# EAGLE design LED_Strip (EAGLE 6.6.0)
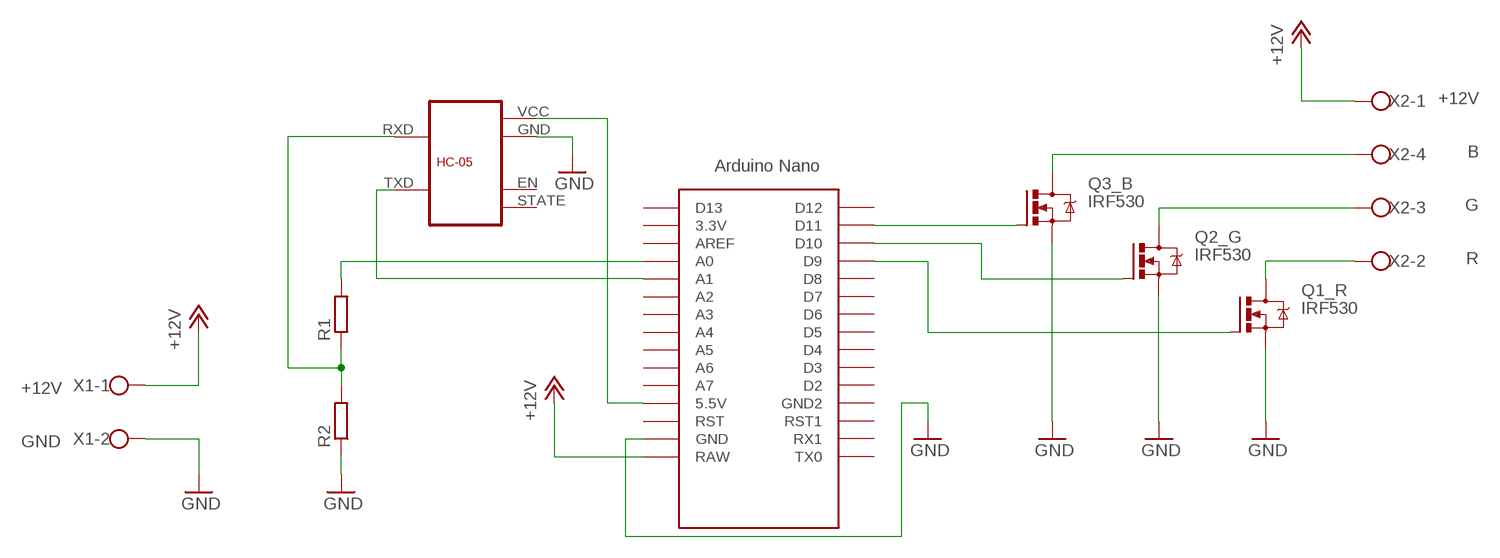
[diagram p0: schematic, sheet 1]

## Parts
Q1_R  IRF530  [TO220BV]
Q2_G  IRF530  [TO220BV]
Q3_B  IRF530  [TO220BV]
R1  R-EU0207/10  [0207/10]
R2  R-EU0207/10  [0207/10]
U$1  PAC_BLUETOOTH_HC-05  [BLUETOOTH_HC-05]
U$2  NANO  [NANO]
X1  W237-102_L  [W237-102_L]
X2  W237-04P_R  [W237-4P_R]

## Nets
+12V: U$2.RAW X1.1 X2.1
GND: Q1_R.S Q2_G.S Q3_B.S R2.1 U$1.GND U$2.GND X1.2
N$1: Q1_R.D X2.2
N$2: Q3_B.G U$2.D11
N$3: Q2_G.G U$2.D10
N$4: Q1_R.G U$2.D9
N$5: Q2_G.D X2.3
N$6: Q3_B.D X2.4
N$7: U$1.VCC U$2.5V(5.5V)
N$8: R1.1 R2.2 U$1.RXD
N$9: R1.2 U$2.A0
N$10: U$1.TXD U$2.A1
Unconnected: U$1.EN U$1.STATE U$2.3.3V U$2.A2 U$2.A3 U$2.A4 U$2.A5 U$2.A6 U$2.A7 U$2.AREF U$2.D2 U$2.D3 U$2.D4 U$2.D5 U$2.D6 U$2.D7 U$2.D8 U$2.D12 U$2.D13 U$2.GND1(GND2) U$2.ICSP1 U$2.ICSP2 U$2.ICSP3 U$2.ICSP4 U$2.ICSP5 U$2.ICSP6 U$2.RST U$2.RST1 U$2.RX1 U$2.TX0

## Notes on the sheet
- +12V
- B
- G
- R
- +12V
- GND

## Library data of the parts
Q1_R Q2_G Q3_B = transistor-power:IRF530: HEXFET Power MOSFET
R1 R2 = HTL_RCL:R-EU: RESISTOR, European symbol
U$1 = bluetooth_HC-05:PAC_BLUETOOTH_HC-05
U$2 = Arduino-clone:NANO: Arduino Nano
X1 = HTL_Printklemmen_links:W237-102_L: WAGO SCREW CLAMP
X2 = HTL_Printklemmen_rechts:W237-04P_R: WAGO SREW CLAMP

## Board
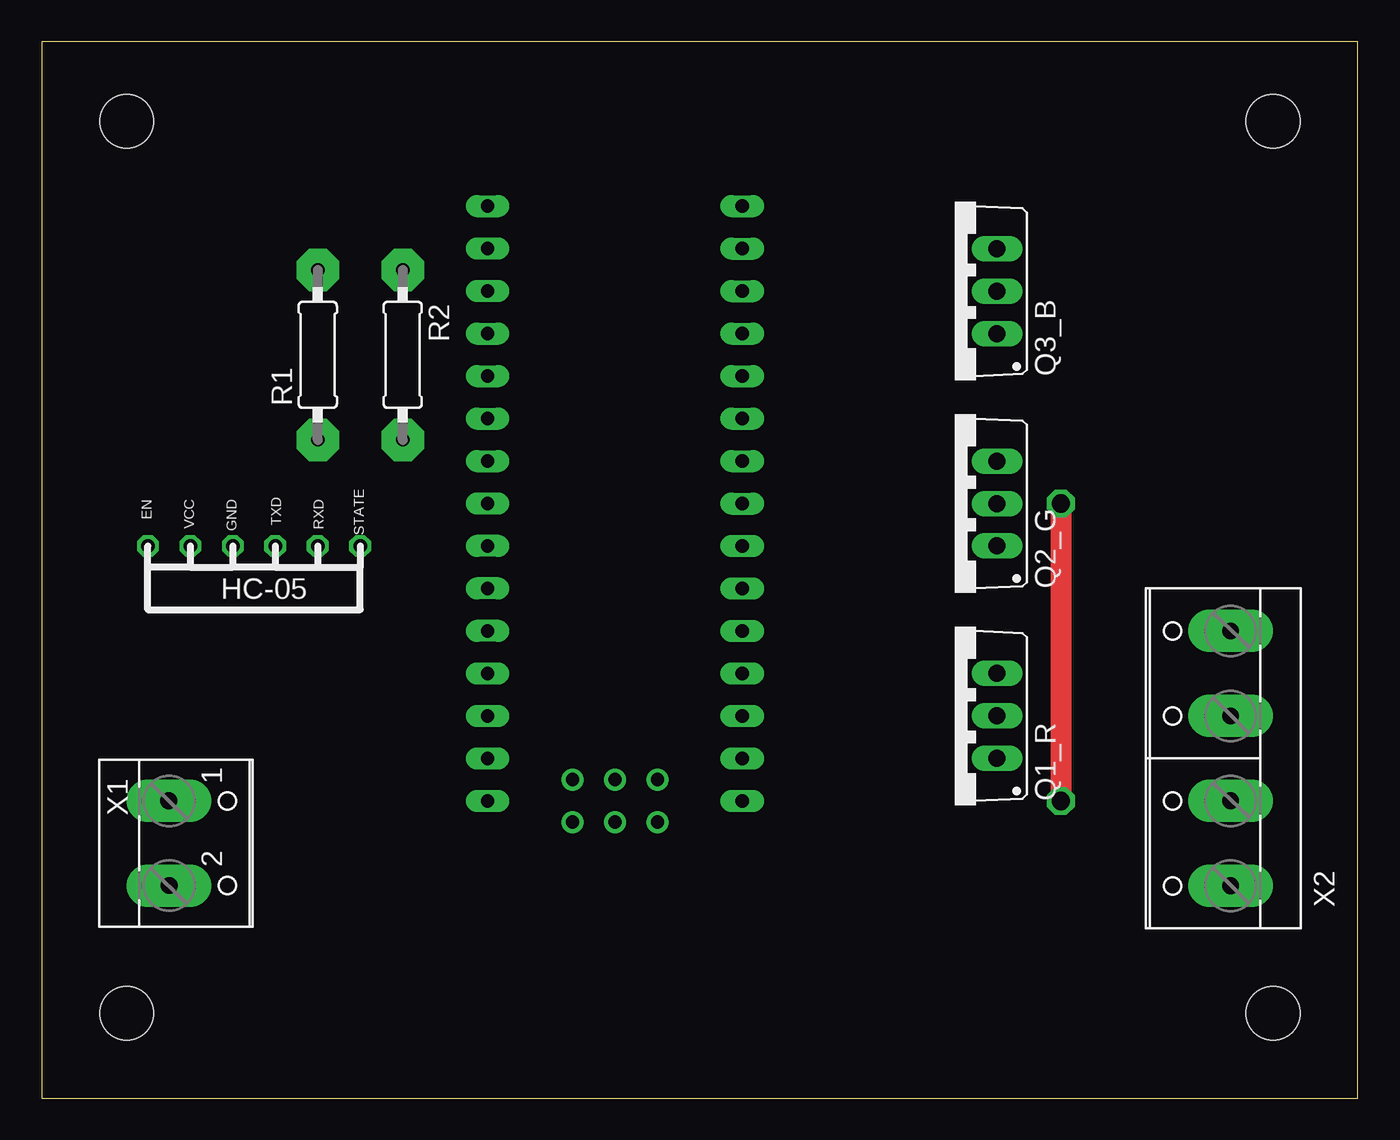
[diagram p1: board, top side]
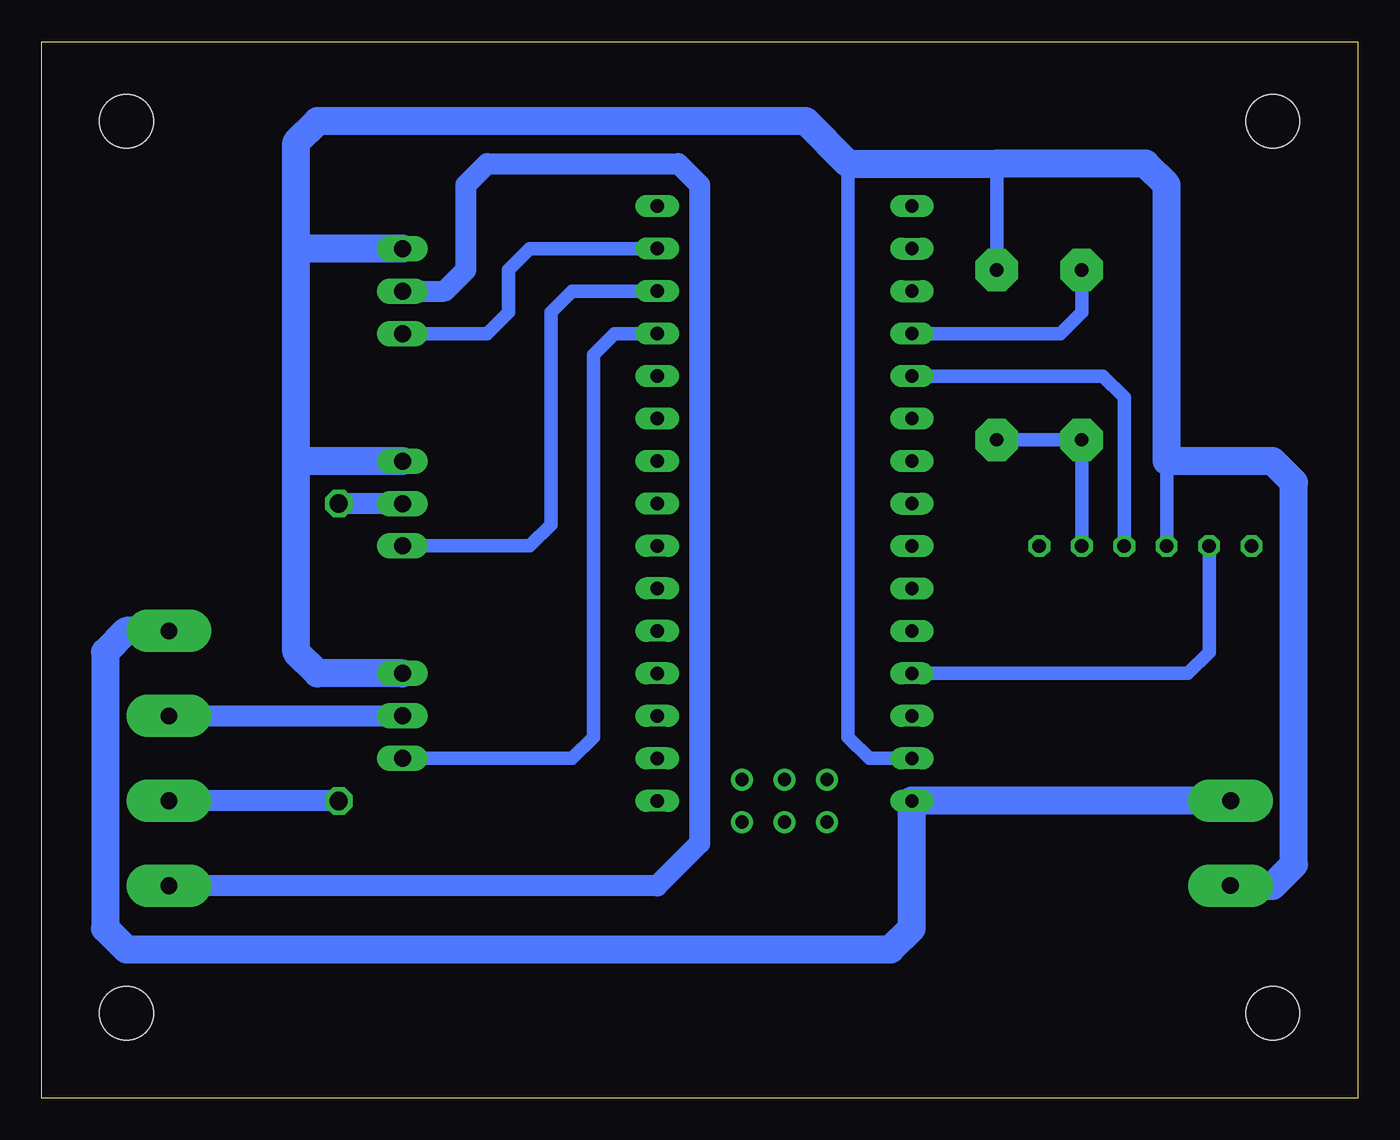
[diagram p2: board, bottom side, seen from below]

Size 78.72 x 63.17 mm. Coordinates in mm from the lower left corner, seen from the top.
Outline: 0,0 78.72,0 78.72,63.17 0,63.17 0,0
Copper layers (1*16): Top 0.035mm / dielectric 1.5mm / Bottom 0.035mm
Design rules "default": minimum track width 10mil, minimum drill 24mil, track to track 8mil, track to pad 8mil, pad to pad 8mil, via to via 8mil, smd to smd 8mil, copper to edge 40mil, drill to drill 8mil, minimum pad ring 10mil, minimum via ring 8mil, stop-mask expansion 4mil, vias tented up to drill 0mil, thermal gap 10mil
Holes 3.2 mm at 5.08,58.42 5.08,5.08 73.66,5.08 73.66,58.42

### Footprints (pad centres in the part's own frame; a part is rotated, then mirrored left to right if it is on the bottom)
TO220BV = drill 1.016 long: D 0,-2.54; G -2.54,-2.54; S 2.54,-2.54
0207/10 = drill 0.8 pad 2.54 octagon: 1 -5.08,0; 2 5.08,0
BLUETOOTH_HC-05 = drill 0.8 octagon: EN 12.7,0; GND 7.62,0; RXD 2.54,0; STATE 0,0; TXD 5.08,0; VCC 10.16,0
NANO = drill 0.8 long: 3.3V -10.16,24.13; 5V -10.16,-1.27; A0 -10.16,19.05; A1 -10.16,16.51; A2 -10.16,13.97; A3 -10.16,11.43; A4 -10.16,8.89; A5 -10.16,6.35; A6 -10.16,3.81; A7 -10.16,1.27; AREF -10.16,21.59; D2 5.08,1.27; D3 5.08,3.81; D4 5.08,6.35; D5 5.08,8.89; D6 5.08,11.43; D7 5.08,13.97; D8 5.08,16.51; D9 5.08,19.05; D10 5.08,21.59; D11 5.08,24.13; D12 5.08,26.67; D13 -10.16,26.67; GND -10.16,-6.35; GND1 5.08,-1.27; RAW -10.16,-8.89; RST -10.16,-3.81; RST1 5.08,-3.81; RX1 5.08,-6.35; TX0 5.08,-8.89 | drill 0.8: ICSP1 -5.08,-10.16; ICSP2 -5.08,-7.62; ICSP3 -2.54,-10.16; ICSP4 -2.54,-7.62; ICSP5 0,-10.16; ICSP6 0,-7.62
W237-102_L = drill 1 pad 2.54 long: 1 -2.551,-0.025; 2 2.525,0
W237-4P_R = drill 1 pad 2.54 long: 1 7.62,0; 2 2.54,0; 3 -2.54,0; 4 -7.62,0

### Placement (x,y rotation side)
Q1_R  54.61,22.86 90 top
Q2_G  54.61,35.56 90 top
Q3_B  54.61,48.26 90 top
R1  16.51,44.45 90 top
R2  21.59,44.45 270 top
U$1  19.05,33.02 180 top
U$2  36.83,26.67 0 top
X1  7.62,15.24 270 top
X2  71.12,20.32 90 top

### Tracks (layer width: path | path; a pad name or v marks a point on that pad's centre or on a via)
+12V
  Bottom 0.61: 26.67,17.79 U$2.RAW
  Bottom 1.676: X1.1 26.67,17.79 | X2.1 73.66,27.94 74.93,26.67 74.93,10.16 73.66,8.89 27.94,8.89 26.67,10.16 U$2.RAW
GND
  Bottom 0.61: 7.61,12.7 X1.2
  Bottom 0.813: U$2.GND 29.21,20.32 30.48,21.59 30.48,55.88 | U$1.GND 11.43,38.1 | R2.1 21.59,55.88
  Bottom 1.676: 7.61,12.7 5.08,12.7 3.81,13.97 3.81,36.83 5.08,38.1 11.43,38.1 11.43,54.61 12.7,55.88 21.59,55.88 30.48,55.88 33.02,58.42 62.23,58.42 63.5,57.15 63.5,50.8 | Q1_R.S 62.23,25.4 63.5,26.67 63.5,38.1 | 63.5,38.1 63.5,50.8 | Q3_B.S 63.5,50.8 | Q2_G.S 63.5,38.1
N$1
  Bottom 1.27: X2.2 Q1_R.D
N$2
  Bottom 0.813: U$2.D11 49.53,50.8 50.8,49.53 50.8,46.99 52.07,45.72 Q3_B.G
N$3
  Bottom 0.813: U$2.D10 46.99,48.26 48.26,46.99 48.26,34.29 49.53,33.02 Q2_G.G
N$4
  Bottom 0.813: U$2.D9 44.45,45.72 45.72,44.45 45.72,21.59 46.99,20.32 Q1_R.G
N$5  (via drill 1.1)
  Top 1.27: v60.96,35.56 v60.96,17.78
  Bottom 1.27: Q2_G.D v60.96,35.56 | v60.96,17.78 X2.3
N$6
  Bottom 1.27: Q3_B.D 54.61,48.26 53.34,49.53 53.34,54.61 52.07,55.88 40.64,55.88 39.37,54.61 39.37,15.24 41.91,12.7 X2.4
N$7
  Bottom 0.813: U$1.VCC 8.89,26.67 10.16,25.4 U$2.5V
N$8
  Bottom 0.813: U$1.RXD 16.51,35.56 R1.1 R2.2
N$9
  Bottom 0.813: R1.2 16.51,46.99 17.78,45.72 U$2.A0
N$10
  Bottom 0.813: U$2.A1 15.24,43.18 13.97,41.91 U$1.TXD